# EAGLE schematic stm32 (EAGLE 9.5.1)
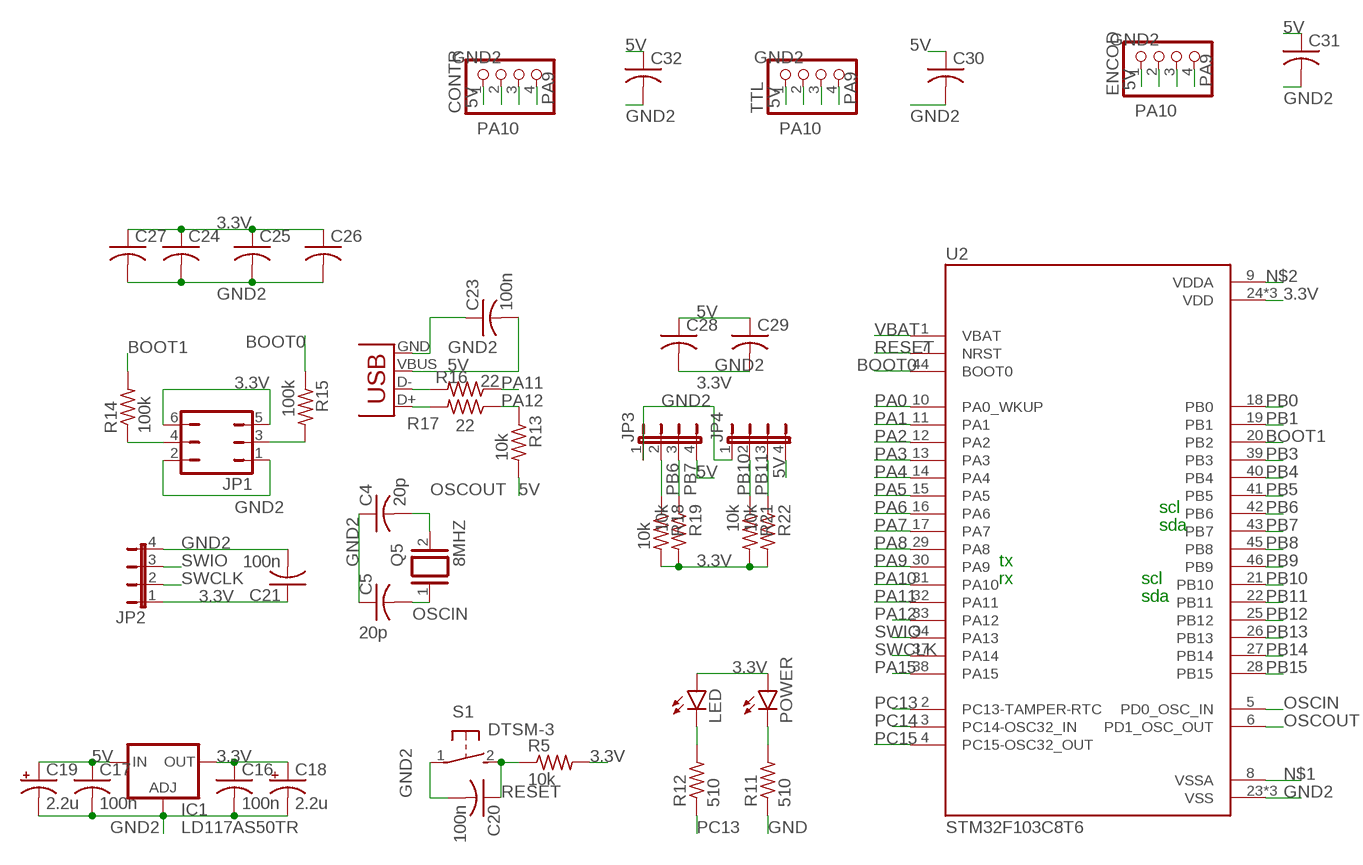
[diagram p0: schematic, sheet 1]

## Parts
C4  20p  C-USC1206  [C1206]
C5  20p  C-USC1206  [C1206]
C16  100n  C-USC1206  [C1206]
C17  100n  C-USC1206  [C1206]
C18  2.2u  CPOL-USE2-5  [E2-5]
C19  2.2u  CPOL-USE2-5  [E2-5]
C20  100n  C-USC1206  [C1206]
C21  100n  C-USC1206  [C1206]
C23  100n  C-USC1206  [C1206]
C24  C-USC1206  [C1206]
C25  C-USC1206  [C1206]
C26  C-USC1206  [C1206]
C27  C-USC1206  [C1206]
C28  C-USC1206  [C1206]
C29  C-USC1206  [C1206]
C30  C-USC1206  [C1206]
C31  C-USC1206  [C1206]
C32  C-USC1206  [C1206]
CONTR  PINHD-1X4  [1X04]
ENCOD  PINHD-1X4  [1X04]
IC1  LD117AS50TR  [SOT223]
JP1  JP3Q  [JP3Q]
JP2  JP4E  [JP4]
JP3  JP4E  [JP4]
JP4  JP4E  [JP4]
LED  LEDCHIPLED_1206  [CHIPLED_1206]
POWER  LEDCHIPLED_1206  [CHIPLED_1206]
Q5  8MHZ  XTAL/S  [QS]
R5  10k  R-US_R1206  [R1206]
R11  510  R-US_R1206  [R1206]
R12  510  R-US_R1206  [R1206]
R13  10k  R-US_R1206  [R1206]
R14  100k  R-US_R1206  [R1206]
R15  100k  R-US_R1206  [R1206]
R16  22  R-US_R1206  [R1206]
R17  22  R-US_R1206  [R1206]
R18  10k  R-US_R1206  [R1206]
R19  10k  R-US_R1206  [R1206]
R21  10k  R-US_R1206  [R1206]
R22  10k  R-US_R1206  [R1206]
S1  DTSM-3  [DTSM-3]
TTL  PINHD-1X4  [1X04]
U2  STM32F103C8T6  [QFP50P900X900X160-48N]
X1  USB-MB-S  [USB-MB-S]

## Nets
3.3V: C16.1 C18.+ C21.1 C24.1 C25.1 C26.1 C27.1 IC1.4(OUT) JP1.5 JP1.6 JP2.1 LED.A POWER.A R5.2 R18.2 R19.2 R21.2 R22.2 U2.24(VDD) U2.36(VDD) U2.48(VDD)
5V: C17.1 C19.+ C23.2 C28.1 C29.1 C30.1 C31.1 C32.1 CONTR.1 ENCOD.1 IC1.3(IN) JP3.4 JP4.4 R13.2 TTL.1 X1.VBUS
BOOT0: R15.1 U2.44(BOOT0)
BOOT1: R14.2 U2.20(PB2)
GND: R11.1
GND2: C4.1 C5.1 C16.2 C17.2 C18.- C19.- C20.2 C21.2 C23.1 C24.2 C25.2 C26.2 C27.2 C28.2 C29.2 C30.2 C31.2 C32.2 CONTR.2 ENCOD.2 IC1.1(ADJ) JP1.1 JP1.2 JP2.4 JP3.1 JP4.1 S1.1 TTL.2 U2.23(VSS) U2.35(VSS) U2.47(VSS) X1.GND
N$1: U2.8(VSSA)
N$2: U2.9(VDDA)
N$5: LED.C R12.2
N$6: POWER.C R11.2
N$8: JP1.3 R15.2
N$11: JP1.4 R14.1
N$19: R16.2 X1.D-
N$21: R17.2 X1.D+
OSCIN: C5.2 Q5.1 U2.5(PD0_OSC_IN)
OSCOUT: C4.2 Q5.2 U2.6(PD1_OSC_OUT)
PA0: U2.10(PA0_WKUP)
PA1: U2.11(PA1)
PA2: U2.12(PA2)
PA3: U2.13(PA3)
PA4: U2.14(PA4)
PA5: U2.15(PA5)
PA6: U2.16(PA6)
PA7: U2.17(PA7)
PA8: U2.29(PA8)
PA9: CONTR.4 ENCOD.4 TTL.4 U2.30(PA9)
PA10: CONTR.3 ENCOD.3 TTL.3 U2.31(PA10)
PA11: R16.1 U2.32(PA11)
PA12: R13.1 R17.1 U2.33(PA12)
PA15: U2.38(PA15)
PB0: U2.18(PB0)
PB1: U2.19(PB1)
PB3: U2.39(PB3)
PB4: U2.40(PB4)
PB5: U2.41(PB5)
PB6: JP3.2 R18.1 U2.42(PB6)
PB7: JP3.3 R19.1 U2.43(PB7)
PB8: U2.45(PB8)
PB9: U2.46(PB9)
PB10: JP4.2 R21.1 U2.21(PB10)
PB11: JP4.3 R22.1 U2.22(PB11)
PB12: U2.25(PB12)
PB13: U2.26(PB13)
PB14: U2.27(PB14)
PB15: U2.28(PB15)
PC13: R12.1 U2.2(PC13-TAMPER-RTC)
PC14: U2.3(PC14-OSC32_IN)
PC15: U2.4(PC15-OSC32_OUT)
RESET: C20.1 R5.1 S1.2 U2.7(NRST)
SWCLK: JP2.2 U2.37(PA14)
SWIO: JP2.3 U2.34(PA13)
VBAT: U2.1(VBAT)

## Notes on the sheet
- scl
- sda
- tx
- rx | scl
- sda

## Library data of the parts
C4 C5 C16 C17 C20 C21 C23-C32 = rcl:C-US: CAPACITOR, American symbol; SPICEPREFIX: C
C18 C19 = rcl:CPOL-US: POLARIZED CAPACITOR, American symbol; SPICEPREFIX: C
CONTR ENCOD TTL = MIA_LIBRARY (2):PINHD-1X4: PIN HEADER
IC1 = v-reg:LD117A?*: Low drop fixed and adjustable positive voltage regulators 1 A Source: http://www.st.com/stonline/products/literature/ds/7194/ld1117axx.pdf
JP1 = jumper:JP3Q: JUMPER
JP2-JP4 = jumper:JP4E: JUMPER
LED POWER = led:LED: LED OSRAM: - CHIPLED LG R971, LG N971, LY N971, LG Q971, LY Q971, LO R971, LY R971 LH N974, LH R974 LS Q976, LO Q976, LY Q976 LO Q996 - Hyper CHIPLED LW Q18S LB Q993, LB Q99A, LB R99A - SideLED LS A670, LO A670, LY A670, LG A670, LP A670 LB A673, LV A673, LT A673, LW A673 LH A674 LY A675 LS A676, LA A676, LO A676, LY A676, LW A676 LS A679, LY A679, LG A679 - Hyper Micro SIDELED® LS Y876, LA Y876, LO Y876, LY Y876 LT Y87S - SmartLED LW L88C, LW L88S LB L89C, LB L89S, LG L890 LS L89K, LO L89K, LY L89K LS L896, LA L896, LO L896, LY L896 - TOPLED LS T670, LO T670, LY T670, LG T670, LP T670 LSG T670, LSP T670, LSY T670, LOP T670, LYG T670 LG T671, LOG T671, LSG T671 LB T673, LV T673, LT T673, LW T673 LH T674 LS T676, LA T676, LO T676, LY T676, LB T676, LH T676, LSB T676, LW T676 LB T67C, LV T67C, LT T67C, LS T67K, LO T67K, LY T67K, LW E67C LS E67B, LA E67B, LO E67B, LY E67B, LB E67C, LV E67C, LT E67C LW T67C LS T679, LY T679, LG T679 LS T770, LO T770, LY T770, LG T770, LP T770 LB T773, LV T773, LT T773, LW T773 LH T774 LS E675, LA E675, LY E675, LS T675 LS T776, LA T776, LO T776, LY T776, LB T776 LHGB T686 LT T68C, LB T68C - Hyper Mini TOPLED® LB M676 - Mini TOPLED Santana® LG M470 LS M47K, LO M47K, LY M47K Source: http://www.osram.convergy.de LUXEON: - LUMILED® LXK2-PW12-R00, LXK2-PW12-S00, LXK2-PW14-U00, LXK2-PW14-V00 LXK2-PM12-R00, LXK2-PM12-S00, LXK2-PM14-U00 LXK2-PE12-Q00, LXK2-PE12-R00, LXK2-PE12-S00, LXK2-PE14-T00, LXK2-PE14-U00 LXK2-PB12-K00, LXK2-PB12-L00, LXK2-PB12-M00, LXK2-PB14-N00, LXK2-PB14-P00, LXK2-PB14-Q00 LXK2-PR12-L00, LXK2-PR12-M00, LXK2-PR14-Q00, LXK2-PR14-R00 LXK2-PD12-Q00, LXK2-PD12-R00, LXK2-PD12-S00 LXK2-PH12-R00, LXK2-PH12-S00 LXK2-PL12-P00, LXK2-PL12-Q00, LXK2-PL12-R00 Source: www.luxeon.com KINGBRIGHT: KA-3528ASYC Source: www.kingbright.com
Q5 = special:XTAL/S: CRYSTAL
R5 R11-R19 R21 R22 = rcl:R-US_: RESISTOR, American symbol; SPICEPREFIX: R
S1 = switch-tact:DTSM-3
U2 = STM32F103C8T6:STM32F103C8T6: Mainstream Performance line, ARM Cortex-M3 MCU with 64 Kbytes Flash, 72 MHz CPU, motor control, USB and CAN; AVAILABILITY: Unavailable; DESCRIPTION: Mainstream Performance line, ARM Cortex-M3 MCU with 64 Kbytes Flash, 72 MHz CPU, motor control, USB and CAN; MF: STMicroelectronics; MP: STM32F103C8T6; PACKAGE: LQFP-48 STMicroelectronics; PRICE: None
X1 = MIA_LIBRARY (2):USB: USB Connectors